# Altium schematic sheet MSP430F5438A.SchDoc: MSP430F5438A
size B; Author: Justin Shetty; Organization: University of Michigan; Address1: 1320 Beal Avenue; Address2: Ann Arbor, MI 48109; DocumentNumber: 8; Revision: v1.0; SheetNumber: 8; SheetTotal: 19
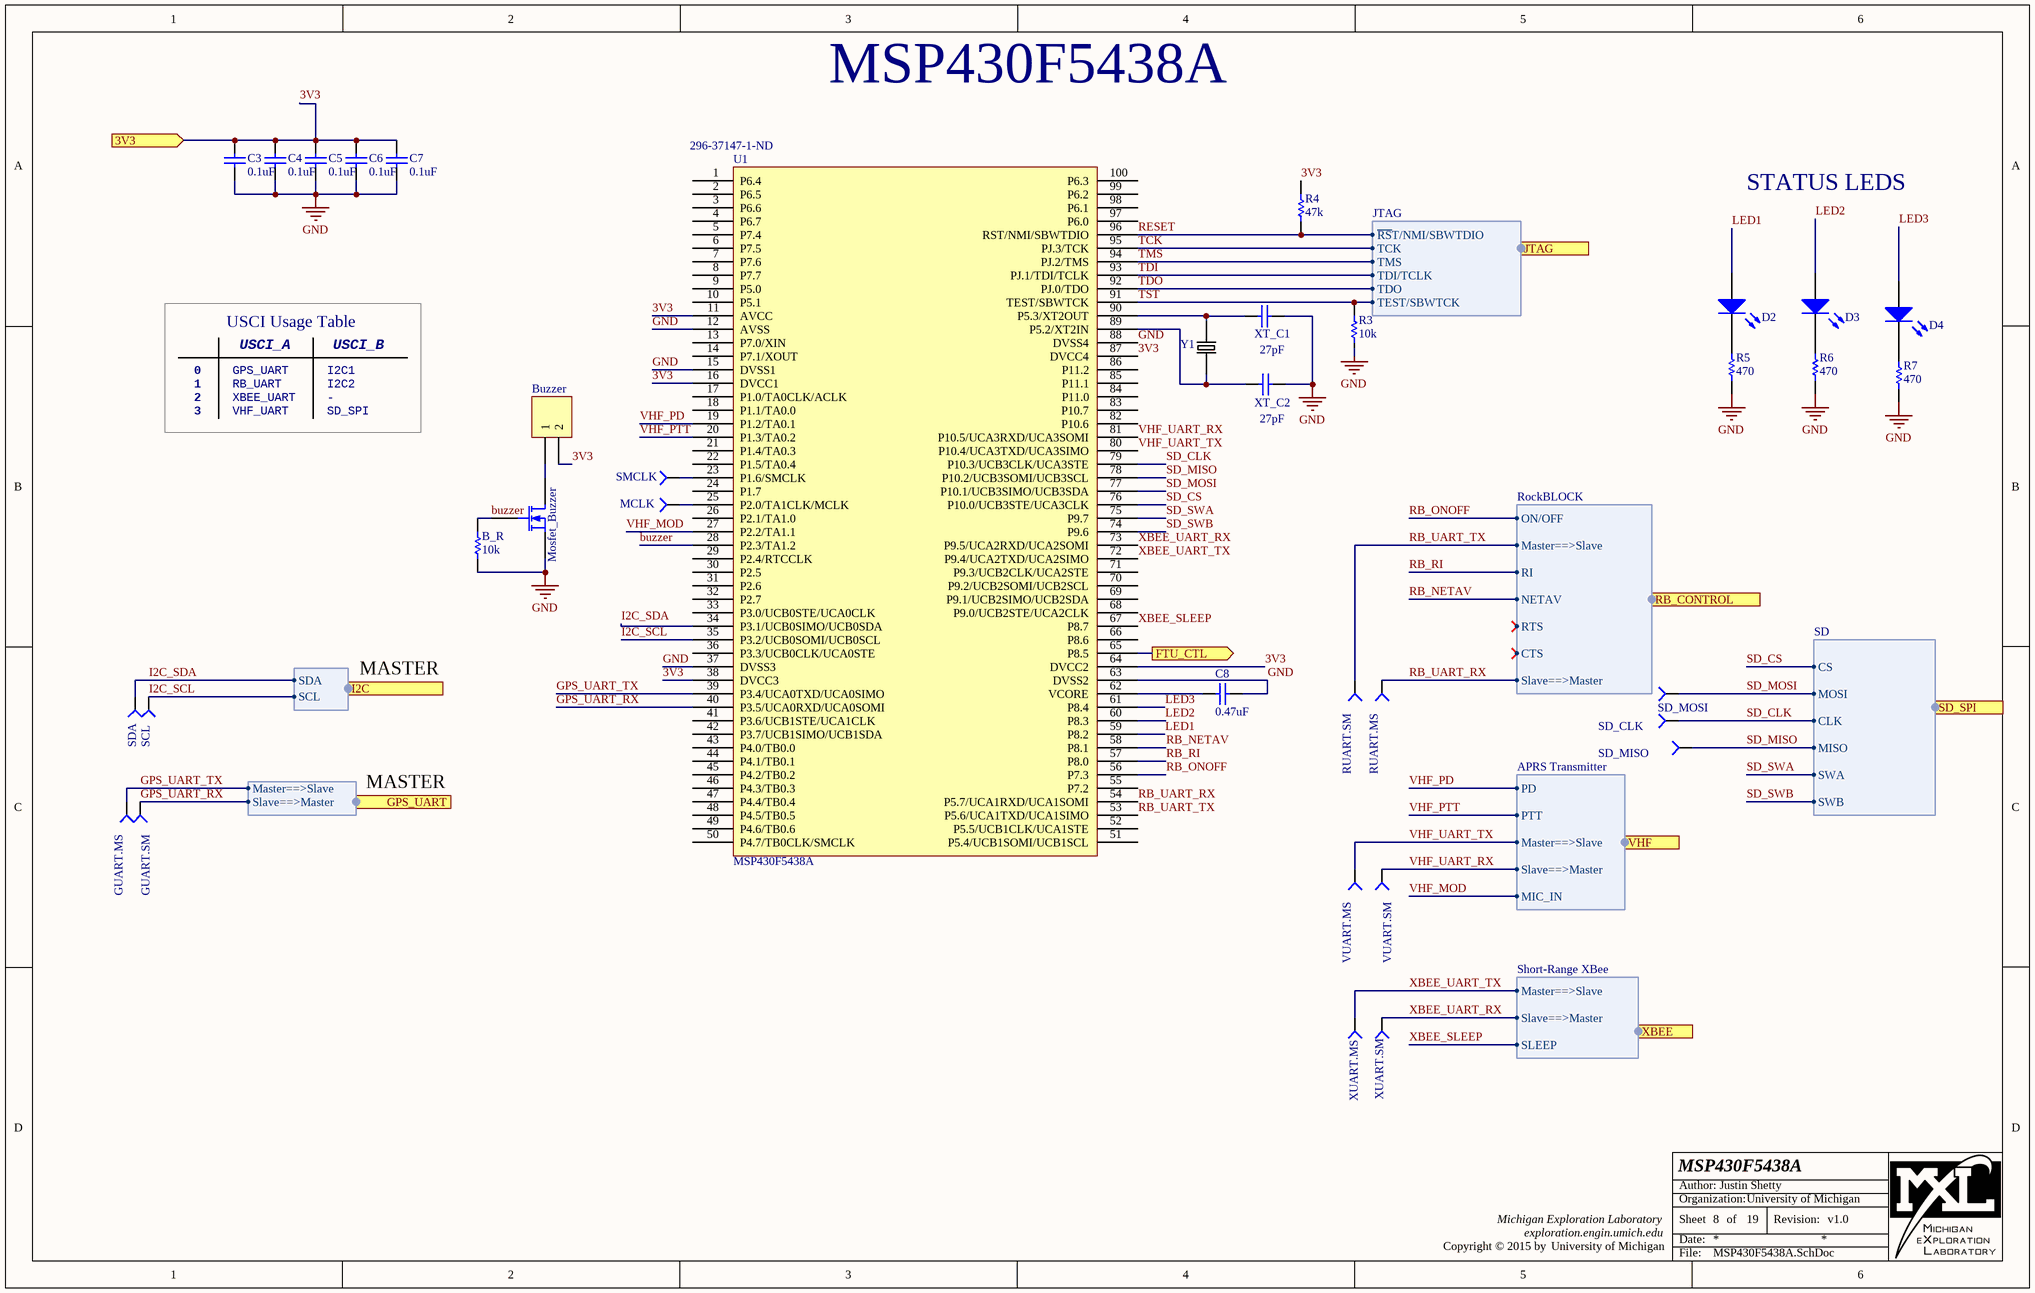
[diagram p0: MSP430F5438A.SchDoc]

## Parts
B_R  value 10k  [J1-0603]  (hidden comment: Resistor)
C3  value 0.1uF  [1608[0603]]  (hidden comment: Capacitor Ceramic)
C4  value 0.1uF  [1608[0603]]  (hidden comment: Capacitor Ceramic)
C5  value 0.1uF  [1608[0603]]  (hidden comment: Capacitor Ceramic)
C6  value 0.1uF  [1608[0603]]  (hidden comment: Capacitor Ceramic)
C7  value 0.1uF  [1608[0603]]  (hidden comment: Capacitor Ceramic)
C8  value 0.47uF  [1608[0603]]  (hidden comment: Capacitor Ceramic)
D2  LED  [J1-0603]  (value not drawn)
D3  LED  [J1-0603]  (value not drawn)
D4  LED  [J1-0603]  (value not drawn)
GUART.MS  Testpoint  [TESTPOINT]  (value not drawn)  (no BOM)
GUART.SM  Testpoint  [TESTPOINT]  (value not drawn)  (no BOM)
MCLK  Testpoint  [TESTPOINT]  (value not drawn)  (no BOM)
Mosfet_Buzzer  MOSFET-N  [SOT-23_M]  (value not drawn)
P4  Buzzer  [Buzzer]
R3  value 10k  [J1-0603]  (hidden comment: Resistor)
R4  value 47k  [J1-0603]  (hidden comment: Resistor)
R5  value 470  [J1-0603]  (hidden comment: Resistor)
R6  value 470  [J1-0603]  (hidden comment: Resistor)
R7  value 470  [J1-0603]  (hidden comment: Resistor)
RUART.MS  Testpoint  [TESTPOINT]  (value not drawn)  (no BOM)
RUART.SM  Testpoint  [TESTPOINT]  (value not drawn)  (no BOM)
SCL  Testpoint  [TESTPOINT]  (value not drawn)  (no BOM)
SD_CLK  Testpoint  [TESTPOINT]  (value not drawn)  (no BOM)
SD_MISO  Testpoint  [TESTPOINT]  (value not drawn)  (no BOM)
SD_MOSI  Testpoint  [TESTPOINT]  (value not drawn)  (no BOM)
SDA  Testpoint  [TESTPOINT]  (value not drawn)  (no BOM)
SMCLK  Testpoint  [TESTPOINT]  (value not drawn)  (no BOM)
U1  MSP430F5438A  Supplier Part Number 1: 296-37147-1-ND  [TSQFP50P1600X1600X160-100L]
VUART.MS  Testpoint  [TESTPOINT]  (value not drawn)  (no BOM)
VUART.SM  Testpoint  [TESTPOINT]  (value not drawn)  (no BOM)
XT_C1  value 27pF  [1608[0603]]  (hidden comment: Capacitor Ceramic)
XT_C2  value 27pF  [1608[0603]]  (hidden comment: Capacitor Ceramic)
XUART.MS  Testpoint  [TESTPOINT]  (value not drawn)  (no BOM)
XUART.SM  Testpoint  [TESTPOINT]  (value not drawn)  (no BOM)
Y1  ECS-160-18-5PXEN-TR  [*XTAL_ECS-160-18-5PXEN-TR]  (value not drawn)

## Ports
3V3 (in), FTU_CTL (out), GPS_UART (harness UART), I2C (harness I2C), JTAG (harness JTAG), RB_CONTROL (harness RockBLOCK), SD_SPI (harness SD), VHF (harness APRS Transmitter), XBEE (harness Short-Range XBee)

## Harnesses
JTAG: ~{RS}T/NMI/SBWTDIO, TCK, TDI/TCLK, TDO, TEST/SBWTCK, TMS
UART: Master==>Slave, Slave==>Master
I2C: SDA, SCL
RockBLOCK: ON/OFF, Master==>Slave, RI, NETAV, RTS, CTS, Slave==>Master
APRS Transmitter: PD, PTT, Master==>Slave, Slave==>Master, MIC_IN
Short-Range XBee: Master==>Slave, Slave==>Master, SLEEP
SD: CS, MOSI, CLK, MISO, SWA, SWB

## Nets
GND: B_R.1 C3.1 C4.1 C5.1 C6.1 C7.1 C8.2 Mosfet_Buzzer.3(S) R3.1 R5.1 R6.1 R7.1 U1.12(AVSS) U1.15(DVSS1) U1.37(DVSS3) U1.63(DVSS2) U1.88(DVSS4) XT_C1.1 XT_C2.1
3V3: C3.2 C4.2 C5.2 C6.2 C7.2 P4.2 R4.1 U1.11(AVCC) U1.16(DVCC1) U1.38(DVCC3) U1.64(DVCC2) U1.87(DVCC4) ; port 3V3
buzzer: B_R.2 Mosfet_Buzzer.2(G) U1.28(P2.3/TA1.2)
FTU_CTL: U1.65(P8.5) ; port FTU_CTL
GPS_UART_RX: GUART.SM.1 U1.40(P3.5/UCA0RXD/UCA0SOMI) ; port GPS_UART.Slave==>Master
GPS_UART_TX: GUART.MS.1 U1.39(P3.4/UCA0TXD/UCA0SIMO) ; port GPS_UART.Master==>Slave
I2C_SCL: SCL.1 U1.35(P3.2/UCB0SOMI/UCB0SCL) ; port I2C.SCL
I2C_SDA: SDA.1 U1.34(P3.1/UCB0SIMO/UCB0SDA) ; port I2C.SDA
LED1: D2.2(K) U1.59(P8.2)
LED2: D3.2(K) U1.60(P8.3)
LED3: D4.2(K) U1.61(P8.4)
RB_NETAV: U1.58(P8.1) ; port RB_CONTROL.NETAV
RB_ONOFF: U1.56(P7.3) ; port RB_CONTROL.ON/OFF
RB_RI: U1.57(P8.0) ; port RB_CONTROL.RI
RB_UART_RX: RUART.MS.1 U1.54(P5.7/UCA1RXD/UCA1SOMI) ; port RB_CONTROL.Slave==>Master
RB_UART_TX: RUART.SM.1 U1.53(P5.6/UCA1TXD/UCA1SIMO) ; port RB_CONTROL.Master==>Slave
RESET: R4.2 U1.96(RST/NMI/SBWTDIO) ; port JTAG.~{RS}T/NMI/SBWTDIO
SD_CLK: SD_CLK.1 U1.79(P10.3/UCB3CLK/UCA3STE) ; port SD_SPI.CLK
SD_CS: U1.76(P10.0/UCB3STE/UCA3CLK) ; port SD_SPI.CS
SD_MISO: SD_MISO.1 U1.78(P10.2/UCB3SOMI/UCB3SCL) ; port SD_SPI.MISO
SD_MOSI: SD_MOSI.1 U1.77(P10.1/UCB3SIMO/UCB3SDA) ; port SD_SPI.MOSI
SD_SWA: U1.75(P9.7) ; port SD_SPI.SWA
SD_SWB: U1.74(P9.6) ; port SD_SPI.SWB
TCK: U1.95(PJ.3/TCK) ; port JTAG.TCK
TDI: U1.93(PJ.1/TDI/TCLK) ; port JTAG.TDI/TCLK
TDO: U1.92(PJ.0/TDO) ; port JTAG.TDO
TMS: U1.94(PJ.2/TMS) ; port JTAG.TMS
TST: R3.2 U1.91(TEST/SBWTCK) ; port JTAG.TEST/SBWTCK
VHF_MOD: U1.27(P2.2/TA1.1) ; port VHF.MIC_IN
VHF_PD: U1.19(P1.2/TA0.1) ; port VHF.PD
VHF_PTT: U1.20(P1.3/TA0.2) ; port VHF.PTT
VHF_UART_RX: U1.81(P10.5/UCA3RXD/UCA3SOMI) VUART.SM.1 ; port VHF.Slave==>Master
VHF_UART_TX: U1.80(P10.4/UCA3TXD/UCA3SIMO) VUART.MS.1 ; port VHF.Master==>Slave
XBEE_SLEEP: U1.67(P8.7) ; port XBEE.SLEEP
XBEE_UART_RX: U1.73(P9.5/UCA2RXD/UCA2SOMI) XUART.SM.1 ; port XBEE.Slave==>Master
XBEE_UART_TX: U1.72(P9.4/UCA2TXD/UCA2SIMO) XUART.MS.1 ; port XBEE.Master==>Slave
NetC8_1: C8.1 U1.62(VCORE)
NetD2_1: D2.1(A) R5.2
NetD3_1: D3.1(A) R6.2
NetD4_1: D4.1(A) R7.2
NetMCLK_1: MCLK.1 U1.25(P2.0/TA1CLK/MCLK)
NetMosfet_Buzzer_1: Mosfet_Buzzer.1(D) P4.1
NetSMCLK_1: SMCLK.1 U1.23(P1.6/SMCLK)
NetU1_89: U1.89(P5.2/XT2IN) XT_C2.2 Y1.1
NetU1_90: U1.90(P5.3/XT2OUT) XT_C1.2 Y1.2

Not connected (* = marked no-connect by the designer): U1 1(P6.4) 2(P6.5) 3(P6.6) 4(P6.7) 5(P7.4) 6(P7.5) 7(P7.6) 8(P7.7) 9(P5.0) 10(P5.1) 13(P7.0/XIN) 14(P7.1/XOUT) 17(P1.0/TA0CLK/ACLK) 18(P1.1/TA0.0) 21(P1.4/TA0.3) 22(P1.5/TA0.4) 24(P1.7) 26(P2.1/TA1.0) 29(P2.4/RTCCLK) 30(P2.5) 31(P2.6) 32(P2.7) 33(P3.0/UCB0STE/UCA0CLK) 36(P3.3/UCB0CLK/UCA0STE) 41(P3.6/UCB1STE/UCA1CLK) 42(P3.7/UCB1SIMO/UCB1SDA) 43(P4.0/TB0.0) 44(P4.1/TB0.1) 45(P4.2/TB0.2) 46(P4.3/TB0.3) 47(P4.4/TB0.4) 48(P4.5/TB0.5) 49(P4.6/TB0.6) 50(P4.7/TB0CLK/SMCLK) 51(P5.4/UCB1SOMI/UCB1SCL) 52(P5.5/UCB1CLK/UCA1STE) 55(P7.2) 66(P8.6) 68(P9.0/UCB2STE/UCA2CLK) 69(P9.1/UCB2SIMO/UCB2SDA) 70(P9.2/UCB2SOMI/UCB2SCL) 71(P9.3/UCB2CLK/UCA2STE) 82(P10.6) 83(P10.7) 84(P11.0) 85(P11.1) 86(P11.2) 97(P6.0) 98(P6.1) 99(P6.2) 100(P6.3)

## Notes on the sheet
- MSP430F5438A
- STATUS LEDS
- USCI_A
- USCI Usage Table
- USCI_B
- 1
- 2
- 0
- 3
- GPS_UART
- XBEE_UART
- RB_UART
- VHF_UART
- I2C1
- -
- I2C2
- SD_SPI
- MASTER
- Michigan Exploration Laboratory
- exploration.engin.umich.edu
- Date:
- Sheet
- Author:
- Organization:
- of
- University of Michigan
- Revision:
- Copyright © 2015 by
- File:

## Library data of the parts
B_R R3-R7 = Resistor: Resistive element
GUART.MS GUART.SM MCLK RUART.MS RUART.SM SCL SD_CLK SD_MISO SD_MOSI SDA SMCLK VUART.MS VUART.SM XUART.MS XUART.SM = Testpoint: Probe point for testing
Mosfet_Buzzer = MOSFET-N: N-Channel MOSFET; pin to pad: 1>3 2>1 3>2; Published: 8-Jun-2000; LatestRevisionDate: 17-Jul-2002; LatestRevisionNote: Re-released for DXP Platform.; PackageVersion: 1995/1996; PackageReference: E3; Publisher: Altium Limited; PackageDescription: TO, Flat Index; 3 In-Line, Axial Leads; Body Dia. 4.6mm; Lead Dia. 0.5 mm (max)
P4 = Header 2: Header, 2-Pin; LatestRevisionDate: 17-Jul-2002; LatestRevisionNote: Re-released for DXP Platform.; Publisher: Altium Limited
U1 = MSP430F438IPZ: Manufacturer: Texas Instruments; Manufacturer Part Number: MSP430F5438AIPZR; Core Processor: MSP430; Core Size: 16-Bit; Speed: 25MHz; Connectivity: I²C, IrDA, LIN, SCI, SPI, UART/USART; Peripherals: Brown-out Detect/Reset, DMA, POR, PWM, WDT; Number of I/O: 87; Program Memory Size: 256KB (256K x 8); Program Memory Type: FLASH; RAM Size: 16K x 8; Voltage - Supply (Vcc/Vdd): 1.8 V ~ 3.6 V; Data Converters: A/D 16x12b; Oscillator Type: Internal; Digikey: 296-37147-1-ND; Supplier 1: Digi-Key; RoHS: RoHS Compliant; Category: Integrated Circuits (ICs); Stock 1: 6499; Pricing 1: 1=10.57, 10=9.5, 25=8.6404, 100=7.8215, 250=7.16624, 500=6.552, 750=6.01965, 1000=5.11875 (USD); Packaging: Cut Tape (CT); EEPROM Size: -; Operating Temperature: -40°C ~ 85°C; Package / Case: 100-LQFP; Supplier Device Package: 100-LQFP (14x14); ComponentLink1URL: http://www.ti.com/lit/ds/symlink/msp430f5418a.pdf; ComponentLink1Description: http://www.ti.com/lit/ds/symlink/msp430f5418a.pdf
Y1 = ECS-160-18-5PXEN-TR: Crystal 16MHz 18pF 2-Pin SMD T/R; MF: ECS Inc.; Digi-Key_Part_Number: XC1695CT-ND; Package: HC49/US ECS International; Digi-Key_Purchase_URL: https://www.digikey.com/product-detail/en/ecs-inc/ECS-160-18-5PXEN-TR/XC1695CT-ND/2213847?utm_source=snapeda&utm_medium=aggregator&utm_campaign=symbol; SnapEDA_Link: https://www.snapeda.com/parts/ECS-160-18-5PXEN-TR/ECS%20Inc./view-part/?ref=snap; MP: ECS-160-18-5PXEN-TR; Value: *